# Altium schematic sheet Controller.SchDoc
size A4; SheetNumber: 4; SheetTotal: 15
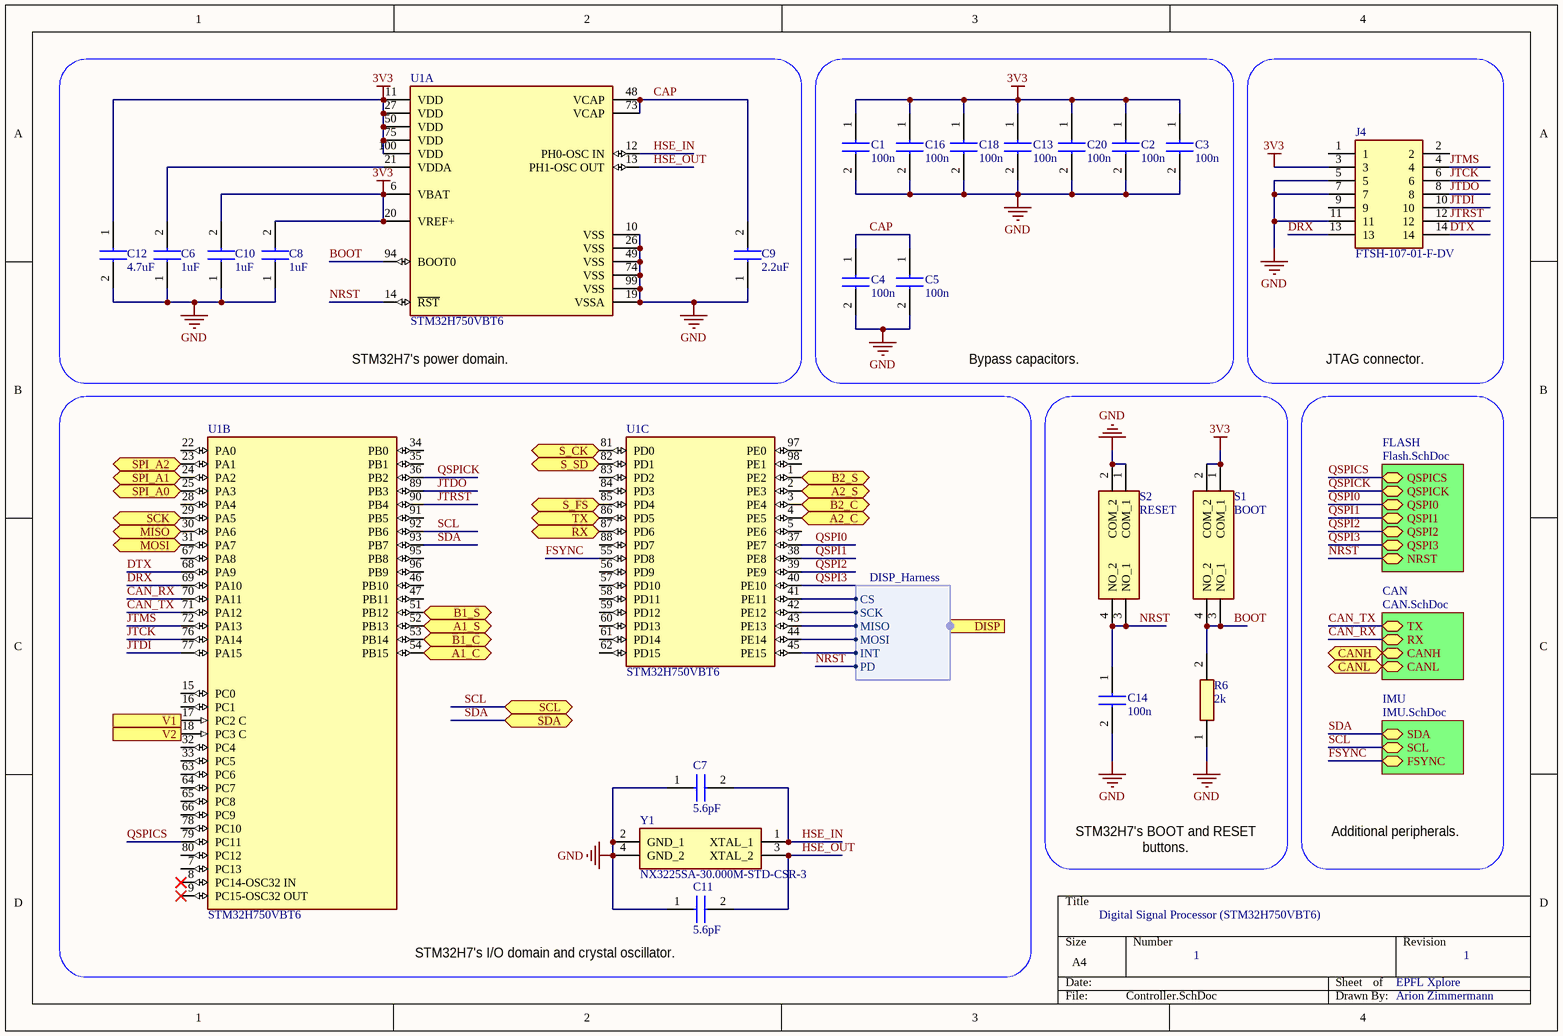
[diagram p0: Controller.SchDoc]

## Parts
C1  value 100n  [CAPC1608X95N]  (hidden comment: C0603C104K5RACTU)
C2  value 100n  [CAPC1608X95N]  (hidden comment: C0603C104K5RACTU)
C3  value 100n  [CAPC1608X95N]  (hidden comment: C0603C104K5RACTU)
C4  value 100n  [CAPC1608X95N]  (hidden comment: C0603C104K5RACTU)
C5  value 100n  [CAPC1608X95N]  (hidden comment: C0603C104K5RACTU)
C6  value 1uF  [CAPC3216X130N]  (hidden comment: C1206C105M5RECTU)
C7  value 5.6pF  [CAPC1608X87N]  (hidden comment: CBR06C569B5GAC)
C8  value 1uF  [CAPC3216X130N]  (hidden comment: C1206C105M5RECTU)
C9  value 2.2uF  [CAPC2012X140N]  (hidden comment: C0805C225K4REC7210)
C10  value 1uF  [CAPC3216X130N]  (hidden comment: C1206C105M5RECTU)
C11  value 5.6pF  [CAPC1608X87N]  (hidden comment: CBR06C569B5GAC)
C12  value 4.7uF  [CAPC2012X140N]  (hidden comment: C0805C475M4PACTU)
C13  value 100n  [CAPC1608X95N]  (hidden comment: C0603C104K5RACTU)
C14  value 100n  [CAPC1608X95N]  (hidden comment: C0603C104K5RACTU)
C16  value 100n  [CAPC1608X95N]  (hidden comment: C0603C104K5RACTU)
C18  value 100n  [CAPC1608X95N]  (hidden comment: C0603C104K5RACTU)
C20  value 100n  [CAPC1608X95N]  (hidden comment: C0603C104K5RACTU)
J4  FTSH-107-01-F-DV  [FTSH-107-XX-YYY-DV]
R6  value 2k  [RESC1608X50N]  (hidden comment: CRCW06032K00JNEB)
S1  BOOT  [LL3301FF065QJ]
S2  RESET  [LL3301FF065QJ]
U1  STM32H750VBT6  [FP-LQFP100-1L-MFG]  (parts A,B,C of 3)
Y1  NX3225SA-30.000M-STD-CSR-3  [NX2520SA192MHzEXS00ACS05400]

## Sub-sheets
CAN = CAN.SchDoc: TX (bidir), RX (bidir), CANH (bidir), CANL (bidir)
FLASH = Flash.SchDoc: QSPICS (bidir), QSPICK (bidir), QSPI0 (bidir), QSPI1 (bidir), QSPI2 (bidir), NRST (bidir), QSPI3 (bidir)
IMU = IMU.SchDoc: SDA (bidir), SCL (bidir), FSYNC (bidir)

## Ports
A1_C (bidir), A1_S (bidir), A2_C (bidir), A2_S (bidir), B1_C (bidir), B1_S (bidir), B2_C (bidir), B2_S (bidir), CANH (bidir), CANL (bidir), DISP (harness DISP_Harness), MISO (bidir), MOSI (bidir), RX (bidir), S_CK (bidir), S_FS (bidir), S_SD (bidir), SCK (bidir), SCL (bidir), SDA (bidir), SPI_A0 (bidir), SPI_A1 (bidir), SPI_A2 (bidir), TX (bidir), V1 (in), V2 (in)

## Harnesses
DISP_Harness: CS, MISO, SCK, MOSI, INT, PD

## Nets
3V3: C1.1 C2.1 C3.1 C8.2 C10.2 C12.1 C13.1 C16.1 C18.1 C20.1 J4.3 S1.1(COM_1) S1.2(COM_2) U1.6(VBAT) U1.11(VDD) U1.20(VREF+) U1.27(VDD) U1.50(VDD) U1.75(VDD) U1.100(VDD)
GND: C1.2 C2.2 C3.2 C4.2 C5.2 C6.1 C7.1 C8.1 C9.1 C10.1 C11.1 C12.2 C13.2 C14.2 C16.2 C18.2 C20.2 J4.5 J4.7 J4.11 R6.1 S2.1(COM_1) S2.2(COM_2) U1.10(VSS) U1.19(VSSA) U1.26(VSS) U1.49(VSS) U1.74(VSS) U1.99(VSS) Y1.2(GND_1) Y1.4(GND_2)
A1_C: U1.54(PB15) ; port A1_C
A1_S: U1.52(PB13) ; port A1_S
A2_C: U1.4(PE5) ; port A2_C
A2_S: U1.2(PE3) ; port A2_S
B1_C: U1.53(PB14) ; port B1_C
B1_S: U1.51(PB12) ; port B1_S
B2_C: U1.3(PE4) ; port B2_C
B2_S: U1.1(PE2) ; port B2_S
BOOT: R6.2 S1.3(NO_1) S1.4(NO_2) U1.94(BOOT0)
CAN_RX: U1.70(PA11) ; sheet CAN/RX
CAN_TX: U1.71(PA12) ; sheet CAN/TX
CANH: port CANH, sheet CAN/CANH
CANL: port CANL, sheet CAN/CANL
CAP: C4.1 C5.1 C9.2 U1.48(VCAP) U1.73(VCAP)
DRX: J4.13 U1.69(PA10)
DTX: J4.14 U1.68(PA9)
FSYNC: U1.55(PD8) ; sheet IMU/FSYNC
HSE_IN: C7.2 U1.12(PH0-OSC_IN) Y1.1(XTAL_1)
HSE_OUT: C11.2 U1.13(PH1-OSC_OUT) Y1.3(XTAL_2)
JTCK: J4.6 U1.76(PA14)
JTDI: J4.10 U1.77(PA15)
JTDO: J4.8 U1.89(PB3)
JTMS: J4.4 U1.72(PA13)
JTRST: J4.12 U1.90(PB4)
MISO: U1.30(PA6) ; port MISO
MOSI: U1.31(PA7) ; port MOSI
NRST: C14.1 S2.3(NO_1) S2.4(NO_2) U1.14(~{RST}) ; sheet FLASH/NRST, port DISP.PD
QSPI0: U1.37(PE7) ; sheet FLASH/QSPI0
QSPI1: U1.38(PE8) ; sheet FLASH/QSPI1
QSPI2: U1.39(PE9) ; sheet FLASH/QSPI2
QSPI3: U1.40(PE10) ; sheet FLASH/QSPI3
QSPICK: U1.36(PB2) ; sheet FLASH/QSPICK
QSPICS: U1.79(PC11) ; sheet FLASH/QSPICS
RX: U1.87(PD6) ; port RX
S_CK: U1.81(PD0) ; port S_CK
S_FS: U1.85(PD4) ; port S_FS
S_SD: U1.82(PD1) ; port S_SD
SCK: U1.29(PA5) ; port SCK
SCL: U1.92(PB6) ; port SCL, sheet IMU/SCL
SDA: U1.93(PB7) ; port SDA, sheet IMU/SDA
SPI_A0: U1.25(PA3) ; port SPI_A0
SPI_A1: U1.24(PA2) ; port SPI_A1
SPI_A2: U1.23(PA1) ; port SPI_A2
TX: U1.86(PD5) ; port TX
V1: U1.17(PC2_C) ; port V1
V2: U1.18(PC3_C) ; port V2
NetC6_2: C6.2 U1.21(VDDA)
NetU1_41: U1.41(PE11) ; port DISP.CS
NetU1_42: U1.42(PE12) ; port DISP.SCK
NetU1_43: U1.43(PE13) ; port DISP.MISO
NetU1_44: U1.44(PE14) ; port DISP.MOSI
NetU1_45: U1.45(PE15) ; port DISP.INT

Not connected (* = marked no-connect by the designer): J4 1 2 9; U1 5(PE6) 7(PC13) 8(PC14-OSC32_IN)* 9(PC15-OSC32_OUT)* 15(PC0) 16(PC1) 22(PA0) 28(PA4) 32(PC4) 33(PC5) 34(PB0) 35(PB1) 46(PB10) 47(PB11) 56(PD9) 57(PD10) 58(PD11) 59(PD12) 60(PD13) 61(PD14) 62(PD15) 63(PC6) 64(PC7) 65(PC8) 66(PC9) 67(PA8) 78(PC10) 80(PC12) 83(PD2) 84(PD3) 88(PD7) 91(PB5) 95(PB8) 96(PB9) 97(PE0) 98(PE1)

## Notes on the sheet
- (near U1) STM32H7's power domain.
- Bypass capacitors.
- JTAG connector.
- STM32H7's BOOT and RESET buttons.
- Additional peripherals.
- Digital Signal Processor (STM32H750VBT6)
- STM32H7's I/O domain and crystal oscillator.
- 1
- EPFL Xplore
- Arion Zimmermann

## Library data of the parts
C1-C5 C13 C14 C16 C18 C20 = C0603C104K5RACTU: Capacitor; Manufacturer_Name: Kemet; Datasheet Link: http://www.farnell.com/datasheets/2205446.pdf; Height: 0.95mm; Manufacturer_Part_Number: C0603C104K5RACTU; Mouser Part Number: 80-C0603C104K5R; Mouser Price/Stock: https://www.mouser.co.uk/ProductDetail/KEMET/C0603C104K5RACTU?qs=l5k%252BbMnNDkkVcnZPSAaaiQ%3D%3D; Arrow Part Number: C0603C104K5RACTU; Arrow Price/Stock: https://www.arrow.com/en/products/c0603c104k5ractu/kemet-corporation; Supplier 1: Mouser; Supplier Part Number 1: 80-C0603C104K5R
C6 C8 C10 = C1206C105M5RECTU: Capacitor; Manufacturer_Name: Kemet; Datasheet Link: https://content.kemet.com/datasheets/KEM_C1090_X7R_ESD.pdf; Height: 1.3mm; Manufacturer_Part_Number: C1206C105M5RECTU; Mouser Part Number: 80-C1206C105M5RECTU; Mouser Price/Stock: https://www.mouser.co.uk/ProductDetail/KEMET/C1206C105M5RECTU?qs=55YtniHzbhBh39CxZCw85g%3D%3D; Arrow Part Number: C1206C105M5RECTU; Arrow Price/Stock: https://www.arrow.com/en/products/c1206c105m5rectu/kemet-corporation; Supplier 1: Mouser; Supplier Part Number 1: 80-C1206C105M5RECTU
C7 C11 = CBR06C569B5GAC: Capacitor; Manufacturer_Name: Kemet; Datasheet Link: http://www.kemet.com/Lists/ProductCatalog/Attachments/490/KEM_C1030_CBR_SMD.pdf; Height: 0.87mm; Manufacturer_Part_Number: CBR06C569B5GAC; Mouser Part Number: 80-CBR06C569B5GAC; Mouser Price/Stock: https://www.mouser.co.uk/ProductDetail/KEMET/CBR06C569B5GAC/?qs=8sjaHP9aayqGSwkvsyWeEw%3D%3D; Arrow Part Number: CBR06C569B5GAC; Arrow Price/Stock: https://www.arrow.com/en/products/cbr06c569b5gac/kemet-corporation; Supplier 1: Mouser; Supplier Part Number 1: 80-CBR06C569B5GAC
C9 = C0805C225K4REC7210: Capacitor; Manufacturer_Name: Kemet; Datasheet Link: https://content.kemet.com/datasheets/KEM_C1090_X7R_ESD.pdf; Height: 1.4mm; Manufacturer_Part_Number: C0805C225K4REC7210; Mouser Part Number: 80-C0805C225K4RECLR; Mouser Price/Stock: https://www.mouser.co.uk/ProductDetail/KEMET/C0805C225K4REC7210?qs=55YtniHzbhCWJdUu8xFadQ%3D%3D; Supplier 1: Mouser; Supplier Part Number 1: 80-C0805C225K4RECLR
C12 = C0805C475J4RACAUTO: Capacitor; Manufacturer_Name: Kemet; Datasheet Link: https://componentsearchengine.com/Datasheets/1/C0805C475J4RACAUTO.pdf; Height: 1.4mm; Manufacturer_Part_Number: C0805C475J4RACAUTO; Mouser Part Number: 80-C0805C475J4RAUTO; Mouser Price/Stock: https://www.mouser.co.uk/ProductDetail/KEMET/C0805C475J4RACAUTO?qs=HXFqYaX1Q2zgZ196jUXcdQ%3D%3D; Arrow Part Number: C0805C475J4RACAUTO; Arrow Price/Stock: https://www.arrow.com/en/products/c0805c475j4racauto/kemet-corporation; Supplier 1: Mouser; Supplier Part Number 1: 80-C0805C475J4RAUTO
J4 = FTSH-107-01-F-DV: Connector; Manufacturer_Name: SAMTEC; Datasheet Link: http://suddendocs.samtec.com/prints/ftsh-1xx-xx-xxx-dv-xxx-xxx-mkt.pdf; Manufacturer_Part_Number: FTSH-107-01-F-DV; Mouser Part Number: 200-FTSH10701FDV; Mouser Price/Stock: https://www.mouser.co.uk/ProductDetail/Samtec/FTSH-107-01-F-DV?qs=0lQeLiL1qyalhkvT7SJ4Kw%3D%3D; Arrow Part Number: FTSH-107-01-F-DV; Arrow Price/Stock: https://www.arrow.com/en/products/ftsh-107-01-f-dv/samtec; Supplier 1: Mouser; Supplier Part Number 1: 200-FTSH10701FDV
R6 = CRCW0603931RFKEA: Resistor; Manufacturer_Name: Vishay; Manufacturer_Part_Number: CRCW0603787RFKEA; Datasheet Link: http://www.vishay.com/docs/20035/dcrcwe3.pdf; Height: 0.5mm; Supplier 1: Mouser; Supplier Part Number 1: 71-CRCW06032K00JNEB
S1 S2 = LL3301AF065QJ: Switch; Manufacturer_Name: E-Switch; Datasheet Link: https://media.digikey.com/pdf/Data%20Sheets/E-Switch%20PDFs/LL3301AF065QJ.pdf; Height: 7.3mm; Manufacturer_Part_Number: LL3301AF065QJ; Mouser Part Number: 612-LL3301AF065QJ; Mouser Price/Stock: https://www.mouser.co.uk/ProductDetail/E-Switch/LL3301AF065QJ?qs=QtyuwXswaQi68RkbBY57jQ%3D%3D; Supplier 1: Mouser; Supplier Part Number 1: 612-LL3301AF065QJ
U1 = CMP-12105-000017-1: IC MCU 32BIT 128KB FLASH 100LQFP; Manufacturer: STMicroelectronics; Number Of Uart Channels: 9; Number Of I/Os: 82; Max Junction Temp: +125°C; Data Bus Width: 32bits; Ram Size: 1MBytes; Min Supply Voltage: 1.62V; Number Of Spi Channels: 6; Number Of Adc Channels: 36; Max Supply Voltage: 3.6V; Standoff Height: 0.05mm; Interface: I2C,SPI,UART,USART,CAN,USB,LIN,IrDA,Ethernet,I2S,Other; Number Of A/D Converters: 3; Number Of I2C Channels: 4; Memory Size: 128KBytes; Frequency: 480MHz; Number Of Timers/Counters: 20; Number Of Ethernet Channels: 1; Core Architecture: ARM Cortex-M7; Number Of Usb Channels: 2; Number Of Pwm Channels: 42; Ambient Temperature Range High: +85°C; Temperature: -40°C to +125°C; ComponentLink2URL: https://www.st.com/resource/en/datasheet/stm32h750vb.pdf; Device Class L2: Embedded Processors and Controllers; Temperature Range Low: -40°C; Octopart: https://octopart.com/stm32h750vbt6-stmicroelectronics-94048547; Category: IC; Manufacturer Part Number: STM32H750VBT6; Height: 1.6mm; Lead Free: Yes; Device Class L1: Integrated Circuits (ICs); Digikey Description: IC MCU 32BIT 128KB FLASH 100LQFP; RoHS: TRUE; Ambient Temperature Range Low: -40°C; Device Class L3: Microcontrollers; ComponentLink2Description: Datasheet; Mouser Description: MCU 32-Bit STM32H750VB ARM Cortex M7 RISC 128KB Flash 1.8V/2.5V/3.3V 100-Pin LQFP Tray; Number Of Cores: 1; Automotive: No; Memory Type: FLASH; Package: LQFP100-1L; Temperature Range High: +125°C
Y1 = NX2520SA-25.000M-STD-CSW-5: Crystal or Oscillator; Manufacturer_Name: NDK; Datasheet Link: https://kr.mouser.com/datasheet/2/905/ndk_08142018_NX2520SA-19.200000MHZ-NBG1-1389014.pdf; Height: 0.55mm; Manufacturer_Part_Number: NX2520SA-25.000M-STD-CSW-5; Mouser Part Number: 344-NX2520SA25MSTSW5; Mouser Price/Stock: https://www.mouser.co.uk/ProductDetail/NDK/NX2520SA-25000M-STD-CSW-5?qs=w%2Fv1CP2dgqoYJPVY2dD4UA%3D%3D; Supplier 1: Mouser; Supplier Part Number 1: 344-NX3225SA30MSTSR3